# EAGLE design Cansat2019_1516_Payload_SectionA_v03 (EAGLE 7.3.0)
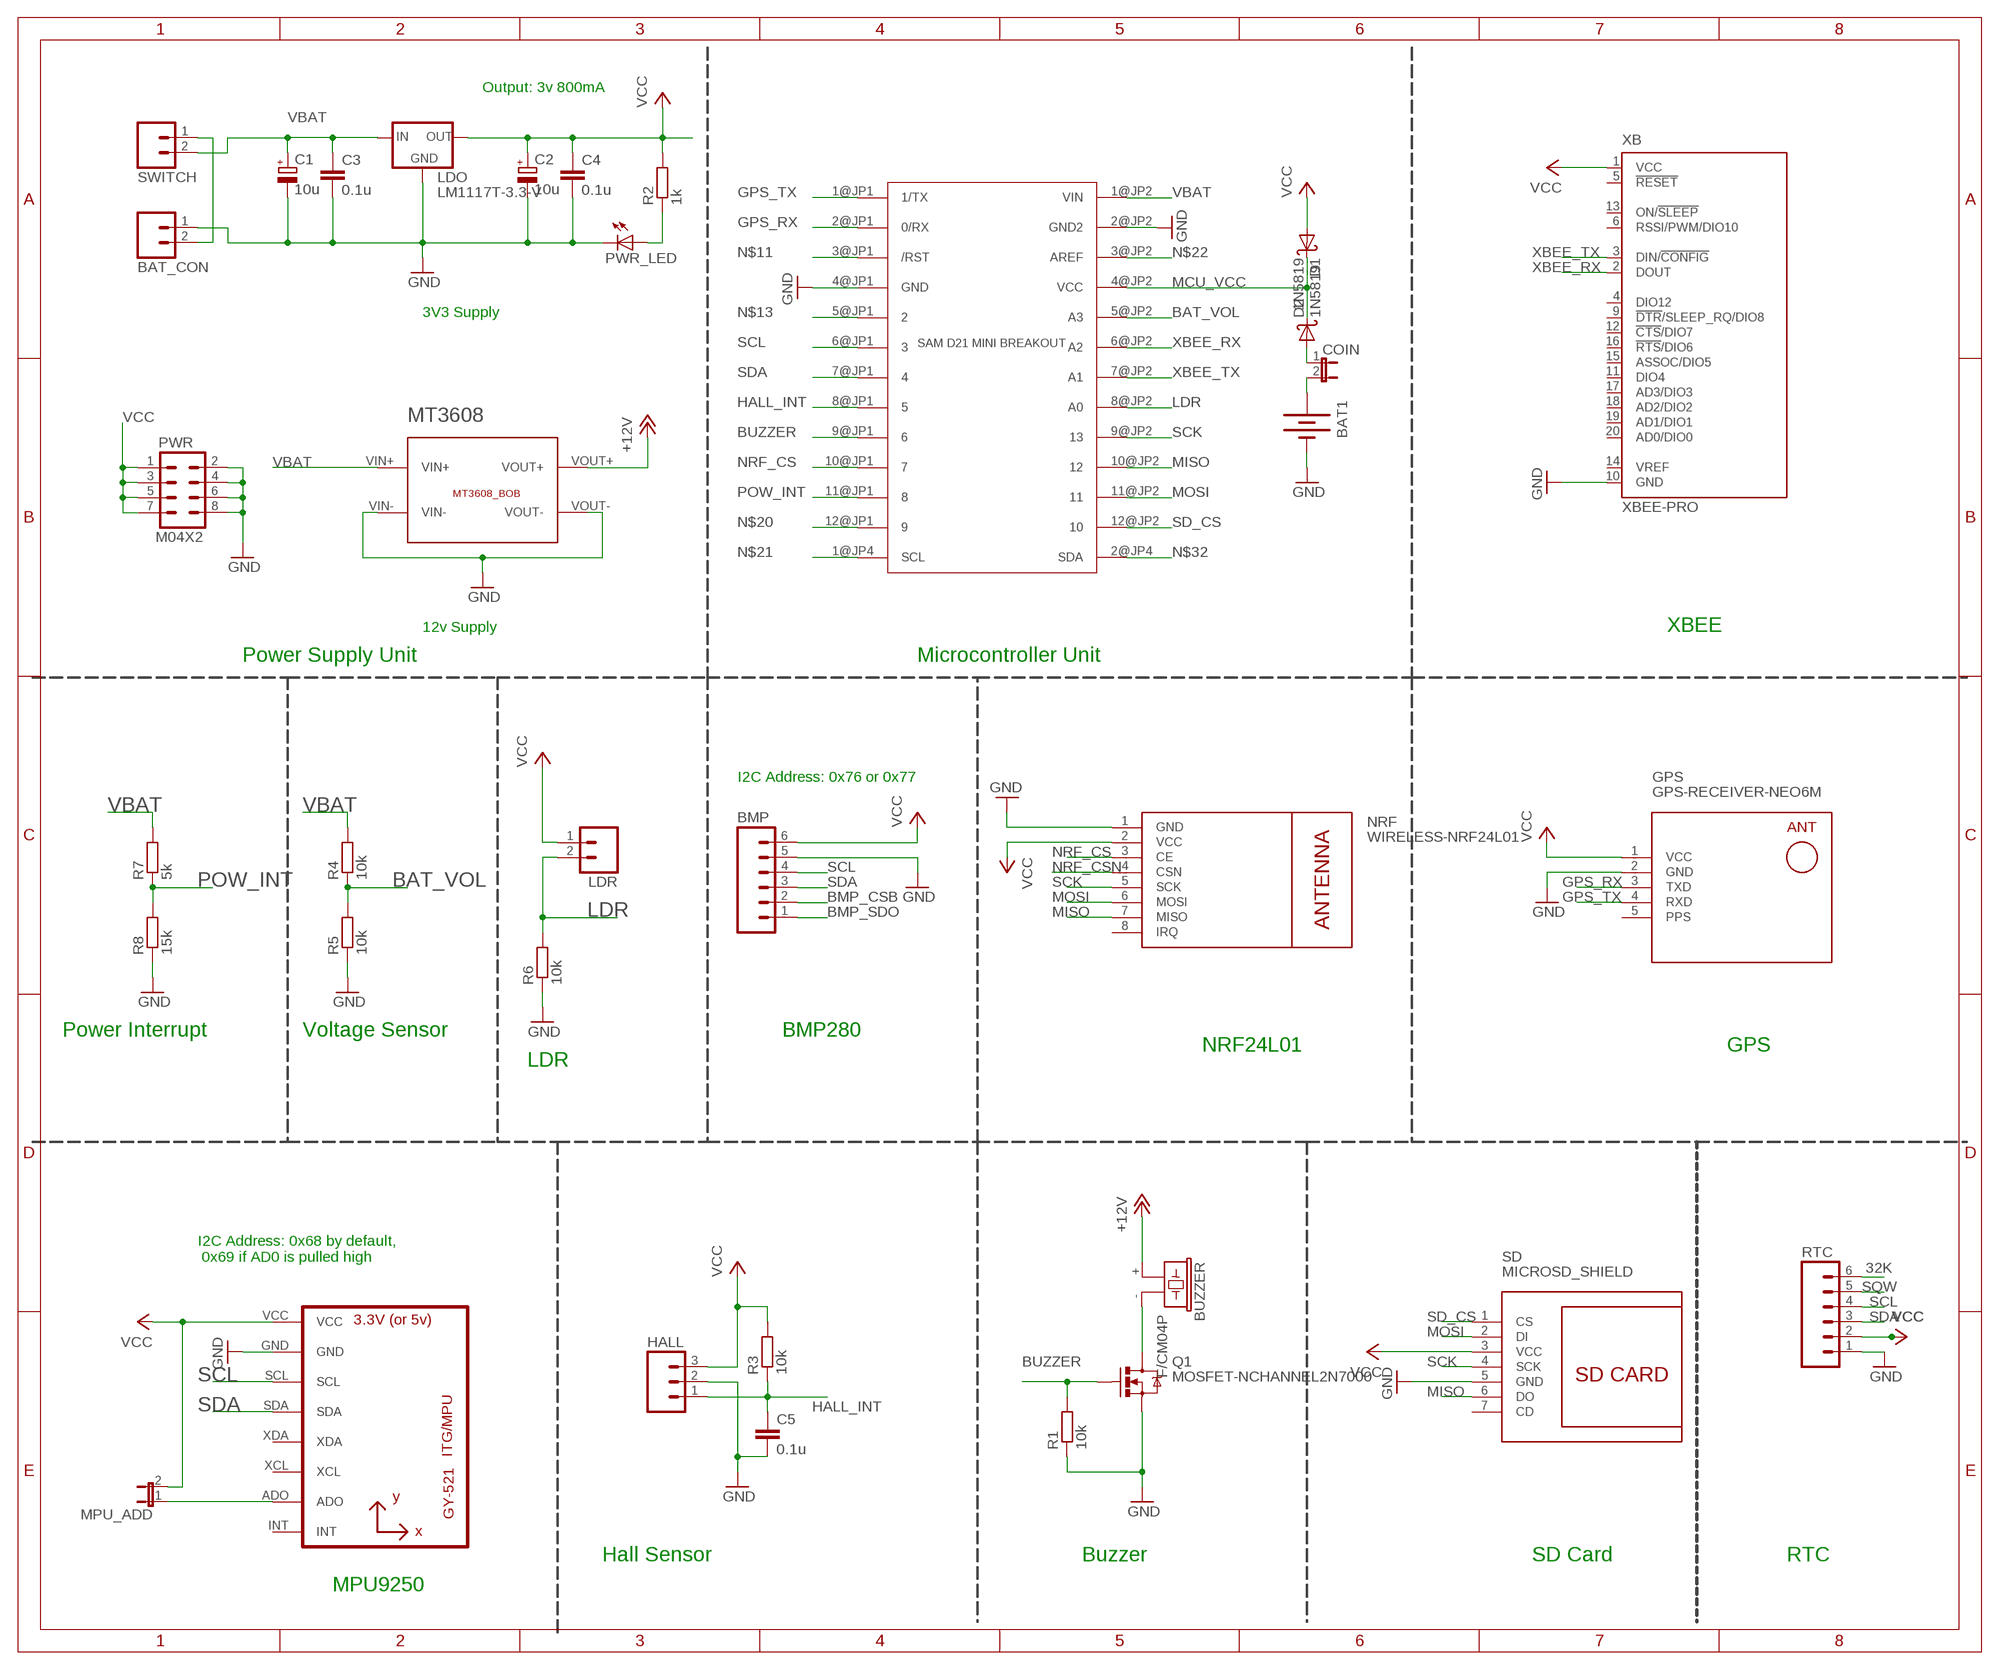
[diagram p0: schematic, sheet 1]

## Parts
BAT1  BATTERY20PTH  [BATTCOM_20MM_PTH]
BAT_CON  M02  [02P]
BMP  M06  [06P]
BUZZER  F/CM04P  [F/CM04P]
C1  10u  CPOL-EUE2.5-6  [E2,5-6]
C2  10u  CPOL-EUE2.5-6  [E2,5-6]
C3  0.1u  C-EU025-025X050  [C025-025X050]
C4  0.1u  C-EU025-025X050  [C025-025X050]
C5  0.1u  C-EU025-025X050  [C025-025X050]
COIN  JUMPER-2PTH  [1X02]
D1  1N5819  [DO41-10]
D2  1N5819  [DO41-10]
GPS  GPS-RECEIVER-NEO6M  [GPS-RECEIVER-NEO6M]
HALL  M03  [03P]
LDO  LM1117T-3.3-V  [TO220V]
LDR  M02  [02P]
MPU  GY-521MPU6050  [GY-521]
MPU_ADD  JUMPER-2PTH  [1X02]
MT3608  MT3608_BOB  [MT3608_BOB]
NRF  WIRELESS-NRF24L01  [WIRELESS-NRF24L01]
PWR  M04X2  [2X4]
PWR_LED  LED3MM  [LED3MM]
Q1  MOSFET-NCHANNEL2N7000  [TO-92]
R1  10k  R-EU_0204/7  [0204/7]
R2  1k  R-EU_0204/7  [0204/7]
R3  10k  R-EU_0204/7  [0204/7]
R4  10k  R-EU_0204/7  [0204/7]
R5  10k  R-EU_0204/7  [0204/7]
R6  10k  R-EU_0204/7  [0204/7]
R7  5k  R-EU_0204/7  [0204/7]
R8  15k  R-EU_0204/7  [0204/7]
RTC  M06  [06P]
SAMD  SAM_D21_MINI_BREAKOUT  [JP1_SPARKFUN-SAMD21-MINI-BREAKOUT-V10]
SD  MICROSD_SHIELD  [MICROSD_SHIELD]
SWITCH  M02  [02P]
XB  XBEE-PRO  [XBEE-PRO]

## Nets
32K: RTC.6
+12V [power]: BUZZER.+ MT3608.VOUT+
BAT_VOL: R4.1 R5.2 SAMD.5@JP2(A3)
BMP_CSB: BMP.2
BMP_SDO: BMP.1
BUZZER: Q1.2(G) R1.2 SAMD.9@JP1
GND [power]: BAT1.2(-) BAT_CON.1 BMP.5 C1.- C2.- C3.2 C4.2 C5.2 GPS.2(GND) HALL.2 LDO.1(GND) MPU.GND MT3608.VIN- MT3608.VOUT- NRF.1(GND) PWR.2 PWR.4 PWR.6 PWR.8 PWR_LED.K(C) Q1.1(S) R1.1 R5.1 R6.1 R8.1 RTC.1 SAMD.2@JP2(GND2) SAMD.4@JP1(GND) SD.5(GND) XB.10(GND)
GPS_RX: GPS.3(TXD) SAMD.2@JP1(0/RX)
GPS_TX: GPS.4(RXD) SAMD.1@JP1(1/TX)
HALL_INT: C5.1 HALL.1 R3.1 SAMD.8@JP1
LDR: LDR.2 R6.2 SAMD.8@JP2(A0)
MCU_VCC [power]: D1.C D2.C SAMD.4@JP2(VCC)
MISO: NRF.7(MISO) SAMD.10@JP2 SD.6(DO)
MOSI: NRF.6(MOSI) SAMD.11@JP2 SD.2(DI)
N$1: BUZZER.- Q1.3(D)
N$2 [power]: COIN.1 D2.A
N$3: PWR_LED.A R2.1
N$5 [power]: BAT1.1(+) COIN.2
N$6: BAT_CON.2 SWITCH.1
N$9: MPU.ADO MPU_ADD.1
N$11: SAMD.3@JP1(/RST)
N$13: SAMD.5@JP1
N$20: SAMD.12@JP1
N$21: SAMD.1@JP4(SCL)
N$22: SAMD.3@JP2(AREF)
N$32: SAMD.2@JP4(SDA)
NRF_CS: NRF.3(CE) SAMD.10@JP1
NRF_CSN: NRF.4(CSN)
POW_INT: R7.1 R8.2 SAMD.11@JP1
SCK: NRF.5(SCK) SAMD.9@JP2 SD.4(SCK)
SCL: BMP.4 MPU.SCL RTC.4 SAMD.6@JP1
SD_CS: SAMD.12@JP2 SD.1(CS)
SDA: BMP.3 MPU.SDA RTC.3 SAMD.7@JP1
SQW: RTC.5
VBAT [power]: C1.+ C3.1 LDO.3(IN) MT3608.VIN+ R4.2 R7.2 SAMD.1@JP2(VIN) SWITCH.2
VCC [power]: BMP.6 C2.+ C4.1 D1.A GPS.1(VCC) HALL.3 LDO.2(OUT) LDR.1 MPU.VCC MPU_ADD.2 NRF.2(VCC) PWR.1 PWR.3 PWR.5 PWR.7 R2.2 R3.2 RTC.2 SD.3(VCC) XB.1(VCC)
XBEE_RX: SAMD.6@JP2(A2) XB.2(DOUT)
XBEE_TX: SAMD.7@JP2(A1) XB.3(DIN/!CONFIG)
Unconnected: MPU.INT MPU.XCL MPU.XDA NRF.8(IRQ) SD.7(CD) XB.4(DIO12) XB.5(!RESET) XB.6(RSSI/PWM/DIO10) XB.9(!DTR!/SLEEP_RQ/DIO8) XB.11(DIO4) XB.12(!CTS!/DIO7) XB.13(ON/!SLEEP) XB.14(VREF) XB.15(ASSOC/DIO5) XB.16(!RTS!/DIO6) XB.17(AD3/DIO3) XB.18(AD2/DIO2) XB.19(AD1/DIO1) XB.20(AD0/DIO0)

## Notes on the sheet
- Output: 3v 800mA
- 3V3 Supply
- 12v Supply | XBEE
- Power Supply Unit | Microcontroller Unit
- I2C Address: 0x76 or 0x77
- Power Interrupt | Voltage Sensor | BMP280
- NRF24L01 | GPS
- LDR
- I2C Address: 0x68 by default,
   0x69 if AD0 is pulled high
- Hall Sensor | Buzzer | SD Card | RTC
- MPU9250

## Power pins joined to a net without a drawn wire
PPS: GPS.5(PPS)

## Library data of the parts
BAT1 = MSP-MB_V12:BATTERY: Battery Holders Various common sizes : AA, AAA, 18650 (PRT-12895), 20mm coin cell and 12mm coin cell. 20MM_4LEGS, BATT-10373
BAT_CON LDR SWITCH = CEDT_JANUARY_2015_v5:M02: AMP QUICK CONNECTOR
BMP RTC = con-amp-quick:M06: AMP QUICK CONNECTOR; OC_FARNELL: unknown; OC_NEWARK: unknown
BUZZER = buzzer:F/CM04P: BUZZER Source: Buerklin; OC_FARNELL: unknown; OC_NEWARK: unknown
C1 C2 = rcl:CPOL-EU: POLARIZED CAPACITOR, European symbol
C3-C5 = rcl:C-EU: CAPACITOR, European symbol
COIN MPU_ADD = SparkFun-Retired:JUMPER-2: Jumper Basic 0.1" spaced jumper. Use with breakaway headers.
D1 D2 = CEDT_JANUARY_2015_v6 (2):1N5819: DIODE general purpose rectifier, 1 A
GPS = diy-modules:GPS-RECEIVER-NEO6M: GPS Receiver Module based on NEO-6 device Short tutorial how to use NEO-6 module with Arduino: http://www.xarg.org/2016/06/neo6mv2-gps-module-with-arduino/ NEO-6 datasheet is available here: https://www.u-blox.com/sites/default/files/products/documents/NEO-6_DataSheet_%28GPS.G6-HW-09005%29.pdf Click here to find device on ebay.com <http://www.ebay.com/sch/gyneo6mv2>
HALL = msp framework:M03: AMP QUICK CONNECTOR
LDO = lm1117:LM1117T-*
MPU = gy-521:GY-521
MT3608 = Breakouts:MT3608_BOB
NRF = diy-modules:WIRELESS-NRF24L01: 2.4 GHz Wireless Module based on NRF24L01 chip More details available here: http://www.electrodragon.com/w/NRF24L01 Click here to find device on ebay.com <http://www.ebay.com/sch/nrf24l01+arduino>
PWR = SparkFun-Connectors:M04X2: .1" header, two rows of four.
PWR_LED = 01_adafruit:LED: LED OSRAM: - CHIPLED LG R971, LG N971, LY N971, LG Q971, LY Q971, LO R971, LY R971 LH N974, LH R974 LS Q976, LO Q976, LY Q976 LO Q996 - Hyper CHIPLED LW Q18S LB Q993, LB Q99A, LB R99A - SideLED LS A670, LO A670, LY A670, LG A670, LP A670 LB A673, LV A673, LT A673, LW A673 LH A674 LY A675 LS A676, LA A676, LO A676, LY A676, LW A676 LS A679, LY A679, LG A679 - Hyper Micro SIDELED® LS Y876, LA Y876, LO Y876, LY Y876 LT Y87S - SmartLED LW L88C, LW L88S LB L89C, LB L89S, LG L890 LS L89K, LO L89K, LY L89K LS L896, LA L896, LO L896, LY L896 - TOPLED LS T670, LO T670, LY T670, LG T670, LP T670 LSG T670, LSP T670, LSY T670, LOP T670, LYG T670 LG T671, LOG T671, LSG T671 LB T673, LV T673, LT T673, LW T673 LH T674 LS T676, LA T676, LO T676, LY T676, LB T676, LH T676, LSB T676, LW T676 LB T67C, LV T67C, LT T67C, LS T67K, LO T67K, LY T67K, LW E67C LS E67B, LA E67B, LO E67B, LY E67B, LB E67C, LV E67C, LT E67C LW T67C LS T679, LY T679, LG T679 LS T770, LO T770, LY T770, LG T770, LP T770 LB T773, LV T773, LT T773, LW T773 LH T774 LS E675, LA E675, LY E675, LS T675 LS T776, LA T776, LO T776, LY T776, LB T776 LHGB T686 LT T68C, LB T68C - Hyper Mini TOPLED® LB M676 - Mini TOPLED Santana® LG M470 LS M47K, LO M47K, LY M47K Source: http://www.osram.convergy.de/
Q1 = SparkFun-DiscreteSemi:MOSFET-NCHANNEL: Common NMOSFET Parts MFG P/N Store ID Prod ID FDD8780 TRANS-09984 SI7820DN TRANS-11055 FDS6630A IC-08089 2N7002PW TRANS-11151 FQP30N06L COM-10213 TRANS-10060 BSS123LT1G TRANS-08345 BSS138 TRANS-00830 BS170 2N7000
R1-R8 = rcl:R-EU_: RESISTOR, European symbol
SAMD = SparkFun-SAMD21-Mini-Breakout:SAM_D21_MINI_BREAKOUT: SPARKFUN-SAMD21-MINI-BREAKOUT
SD = Breakouts:MICROSD_SHIELD
XB = xbee:XBEE: XBee (TM) /XBee-PRO(TM) OEM RF Modules Source: MaxStream, Inc. xbee_productmanual.pdf; MPN: XBP24-AWI-001; OC_FARNELL: 1337916; OC_NEWARK: 42M2667

## Net classes
0 default: width 0.305 mm
1 power: width 0.61 mm, clearance 0.305 mm

## Board
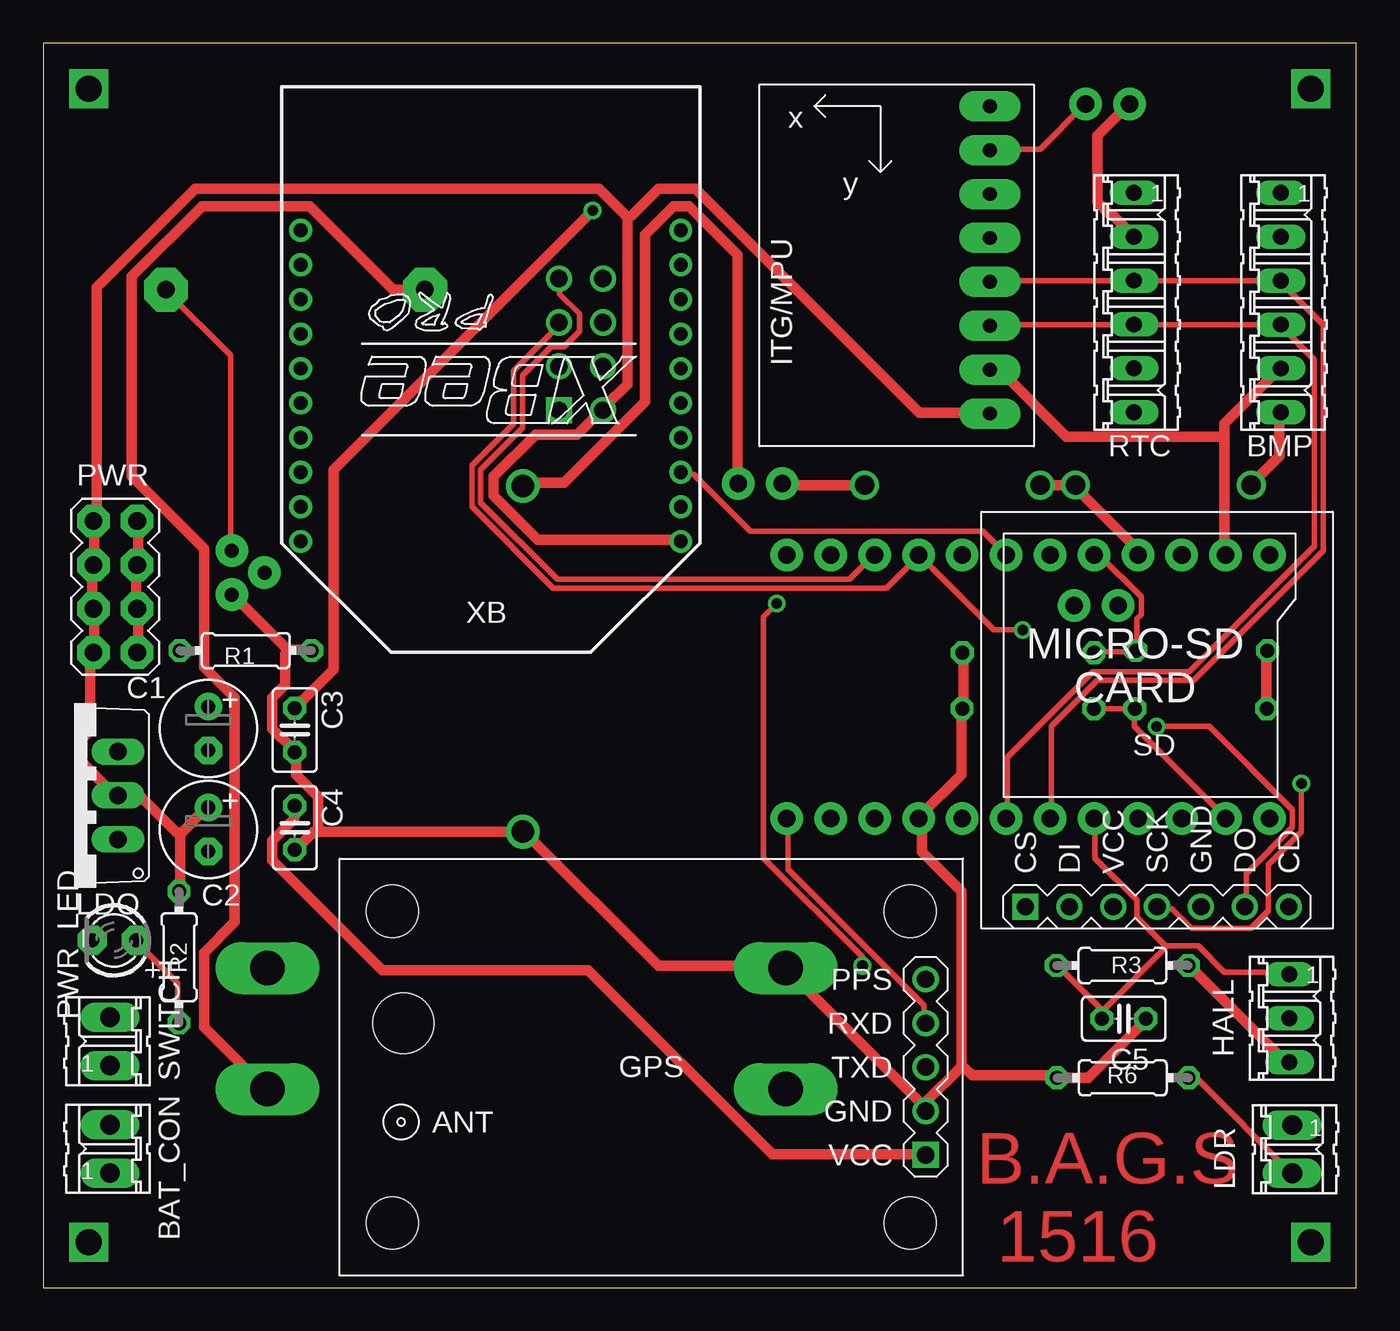
[diagram p1: board, top side]
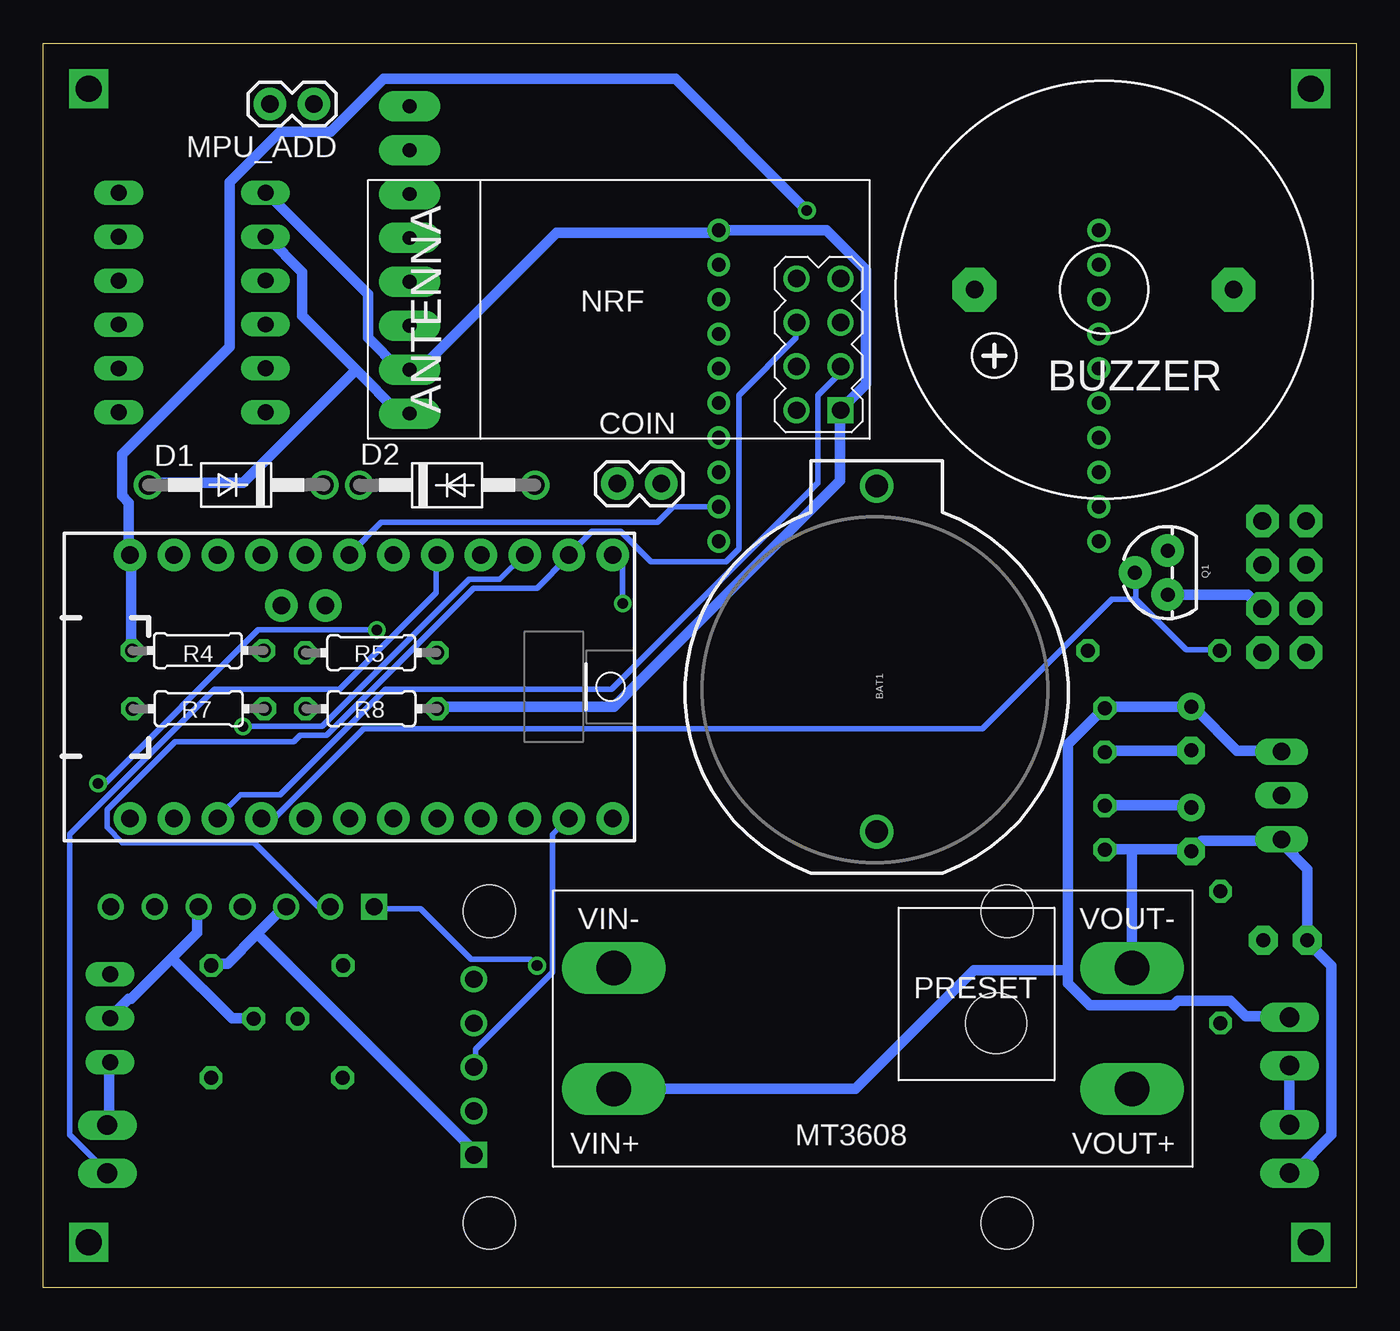
[diagram p2: board, bottom side, seen from below]

Size 76 x 72 mm. Coordinates in mm from the lower left corner, seen from the top.
Outline: 76,72 0,72 0,0 76,0 76,72
Copper layers (1*16): Top 0.035mm / dielectric 1.5mm / Bottom 0.035mm
Design rules "default": minimum track width 10mil, minimum drill 24mil, track to track 8mil, track to pad 8mil, pad to pad 8mil, via to via 8mil, smd to smd 8mil, copper to edge 40mil, drill to drill 8mil, minimum pad ring 10mil, minimum via ring 8mil, stop-mask expansion 4mil, vias tented up to drill 0mil, thermal gap 10mil

### Footprints (pad centres in the part's own frame; a part is rotated, then mirrored left to right if it is on the bottom)
BATTCOM_20MM_PTH = drill 1.3: 1 11.85,0; 2 -8.15,0
02P = drill 1.143 long: 1 -1.397,0; 2 1.397,0
06P = drill 0.914 long: 1 -6.35,0; 2 -3.81,0; 3 -1.27,0; 4 1.27,0; 5 3.81,0; 6 6.35,0
F/CM04P = drill 1.016 pad 2.54 octagon: + 7.493,0; - -7.493,0
E2,5-6 = drill 0.813 pad 1.6: + -1.27,0 | drill 0.813 pad 1.6 octagon: - 1.27,0
C025-025X050 = drill 0.813 octagon: 1 -1.27,0; 2 1.27,0
1X02 = drill 1.016 pad 1.88: 1 0,0; 2 2.54,0
DO41-10 = drill 1.118: A 5.08,0; C -5.08,0
GPS-RECEIVER-NEO6M = drill 1 square: 1 -15.875,5.08 | drill 1: 2 -15.875,2.54; 3 -15.875,0; 4 -15.875,-2.54; 5 -15.875,-5.08 | hole 3: -14.986,9.017; -14.986,-9.017; 14.986,-9.017; 14.986,9.017 | hole 3.5: 14.351,-2.54
03P = drill 0.914 long: 1 -2.54,0; 2 0,0; 3 2.54,0
TO220V = drill 1.016 long: 1 -2.54,-2.54; 2 0,-2.54; 3 2.54,-2.54
GY-521 = drill 0.8 pad 1.778 long: ADO -8.89,-6.35; GND -8.89,6.35; INT -8.89,-8.89; SCL -8.89,3.81; SDA -8.89,1.27; VCC -8.89,8.89; XCL -8.89,-3.81; XDA -8.89,-1.27
MT3608_BOB = drill 2 pad 3 long: VIN+ 33.5,-4.5; VIN- 33.5,-11.5; VOUT+ 3.5,-4.5; VOUT- 3.5,-11.5
WIRELESS-NRF24L01 = drill 1 square: 1 -12.7,6.35 | drill 1: 2 -10.16,6.35; 3 -12.7,3.81; 4 -10.16,3.81; 5 -12.7,1.27; 6 -10.16,1.27; 7 -12.7,-1.27; 8 -10.16,-1.27
2X4 = drill 1.016 pad 1.88 octagon: 1 -3.81,-1.27; 2 -3.81,1.27; 3 -1.27,-1.27; 4 -1.27,1.27; 5 1.27,-1.27; 6 1.27,1.27; 7 3.81,-1.27; 8 3.81,1.27
LED3MM = drill 0.813 pad 1.676 octagon: A -1.27,0; K 1.27,0
TO-92 = drill 0.813 pad 1.88: 1 -1.27,0; 2 0,1.905; 3 1.27,0
0204/7 = drill 0.813 octagon: 1 -3.81,0; 2 3.81,0
JP1_SPARKFUN-SAMD21-MINI-BREAKOUT-V10 = drill 1.016 pad 1.88: 1@JP1 1.27,1.27; 1@JP2 16.51,29.21; 1@JP4 13.589,17.907; 2@JP1 1.27,3.81; 2@JP2 16.51,26.67; 2@JP4 13.589,20.447; 3@JP1 1.27,6.35; 3@JP2 16.51,24.13; 4@JP1 1.27,8.89; 4@JP2 16.51,21.59; 5@JP1 1.27,11.43; 5@JP2 16.51,19.05; 6@JP1 1.27,13.97; 6@JP2 16.51,16.51; 7@JP1 1.27,16.51; 7@JP2 16.51,13.97; 8@JP1 1.27,19.05; 8@JP2 16.51,11.43; 9@JP1 1.27,21.59; 9@JP2 16.51,8.89; 10@JP1 1.27,24.13; 10@JP2 16.51,6.35; 11@JP1 1.27,26.67; 11@JP2 16.51,3.81; 12@JP1 1.27,29.21; 12@JP2 16.51,1.27
MICROSD_SHIELD = drill 1 square: 1 1.27,17.78 | drill 1: 2 1.27,15.24; 3 1.27,12.7; 4 1.27,10.16; 5 1.27,7.62; 6 1.27,5.08; 7 1.27,2.54
XBEE-PRO = drill 0.8 pad 1.27: 1 -11,9; 2 -11,7; 3 -11,5; 4 -11,3; 5 -11,1; 6 -11,-1; 7 -11,-3; 8 -11,-5; 9 -11,-7; 10 -11,-9; 11 11,-9; 12 11,-7; 13 11,-5; 14 11,-3; 15 11,-1; 16 11,1; 17 11,3; 18 11,5; 19 11,7; 20 11,9

### Placement (x,y rotation side)
BAT1  27.76,34.53 90 bottom
BAT_CON  3.87,8.03 90 top
BMP  71.63,56.99 270 top
BUZZER  14.6,57.74 180 bottom
C1  9.56,32.35 270 top
C2  9.56,26.51 270 top
C3  14.56,32.26 270 top
C4  14.56,26.61 270 top
C5  62.54,15.56 0 top
COIN  42.77,46.52 0 bottom
D1  64.83,46.44 180 bottom
D2  52.62,46.44 0 bottom
GPS  35.2,12.76 180 top
HALL  72.13,15.59 270 top
LDO  1.79,28.48 90 top
LDR  72.29,8.01 270 top
MPU  45.91,59.47 180 top
MPU_ADD  60.33,68.48 180 bottom
MT3608  9.48,6.99 180 bottom
NRF  42.55,57.11 180 bottom
PWR  4.17,40.55 270 top
PWR_LED  4.1,20.09 180 top
Q1  10.91,41.37 90 bottom
R1  11.72,36.86 180 top
R2  7.86,19.12 90 top
R3  62.46,18.64 0 top
R4  67.05,36.86 180 bottom
R5  57.02,36.73 180 bottom
R6  62.48,12.14 0 top
R7  67,33.5 180 bottom
R8  57,33.5 180 bottom
RTC  63.13,57 270 top
SAMD  41.77,25.87 90 bottom
SD  74.63,20.77 90 top
SWITCH  3.87,14.25 90 top
XB  25.9,52.18 180 top

### Tracks (layer width: path | path; a pad name or v marks a point on that pad's centre or on a via)
+12V
  Top 0.61: BUZZER.+ 22.02,57.74 20.24,57.74 15.41,62.57 9.19,62.57 5.13,58.5 5.13,46.95 9.32,42.76 9.32,35.9 11.1,34.12 11.1,21.17 9.32,19.39 9.32,15.07 12.87,11.51 MT3608.VOUT+
BAT_VOL
  Top 0.305: R5.2 60.88,36.79 63.16,36.79 R4.1 63.29,36.91 63.29,38.69 63.55,38.95 63.55,39.96 61.13,42.38 60.88,42.38 SAMD.5@JP2
BUZZER
  Bottom 0.305: 12.75,39.83 9.82,36.91 7.92,36.91 R1.2 | 12.75,39.83 12.75,41.36 Q1.2 | 12.75,39.83 14.14,39.83 21.64,32.34 57.45,32.34 62.53,27.26 63.29,27.26 SAMD.9@JP1
GND
  Top 0.61: 68.37,49.23 68.37,42.5 SAMD.2@JP2 | 68.37,49.23 68.37,50 71.55,53.17 BMP.5 | 68.37,49.23 59.23,49.23 55.42,53.04 54.91,53.04 MPU.GND | R5.1 53.26,36.66 53.26,33.61 R8.1 53.13,33.23 53.13,29.67 50.72,27.26 50.72,27.14 SAMD.4@JP1 50.85,26.88 50.85,25.23 53.13,22.94 53.13,12.78 | 51.1,10.12 GPS.2 | GPS.2 50.97,10.5 43.1,18.37 MT3608.VIN- 42.72,18.63 35.61,18.63 27.99,26.25 BAT1.2 27.73,26.37 15.92,26.37 | 71.04,15.58 72.06,15.58 HALL.2 | 14.14,36.91 15.41,36.91 R1.1 | 14.14,36.91 10.97,40.09 Q1.1 | PWR.8 5.51,36.79 5.51,39.2 PWR.6 5.38,39.58 5.38,41.74 PWR.4 5.51,42.12 5.51,44.28 PWR.2 | 15.92,26.37 15.67,26.37 14.65,25.36 C4.2 | 15.92,26.37 15.92,28.41 14.65,29.67 14.65,30.94 C3.2 14.4,31.2 13.25,32.34 13.25,34.12 14.02,34.88 14.02,36.66 14.14,36.91 | C5.2 63.8,15.45 60.5,12.15 58.72,12.15 R6.1 58.47,12.28 53.77,12.28 53.39,12.66 53.13,12.78 | 53.13,12.78 51.1,10.75 GPS.2
  Bottom 0.61: RTC.1 63.04,63.33 57.2,57.49 57.2,54.95 55.42,53.17 54.91,53.17 MPU.GND 54.53,53.17 54.15,53.17 46.27,61.04 37.13,61.04 XB.10 36.88,61.17 30.65,61.17 28.37,58.89 28.37,52.28 29.76,50.88 NRF.1 29.89,50.5 29.89,46.69 42.97,33.61 53.13,33.61 R8.1 | 68.56,19.07 67.1,20.53 67.1,21.93 SD.5 | 68.56,19.07 70.91,16.72 71.04,16.72 72.06,15.7 HALL.2 | Q1.1 10.84,40.09 6.27,40.09 5.51,39.33 PWR.6 | C3.2 14.52,31.07 9.57,31.07 C1.- | 13,25.36 9.57,25.36 C2.- 9.32,25.48 8.94,25.87 4.36,25.87 LDO.1 4.24,25.61 2.84,24.21 2.84,20.15 PWR_LED.K 2.71,19.9 1.44,18.63 1.44,8.85 3.6,6.69 3.86,6.69 BAT_CON.1 | 13,25.36 14.52,25.36 C4.2 | 13,25.36 13,18.5 MT3608.VOUT- | 68.56,19.07 65.07,15.58 63.93,15.58 C5.2
GPS_RX
  Bottom 0.305: GPS.3 50.97,12.78 50.97,13.8 46.53,18.24 46.53,26.25 45.64,27.14 SAMD.2@JP1
GPS_TX
  Top 0.305: GPS.4 50.97,15.32 50.97,16.34 43.1,24.21 43.1,27.14 SAMD.1@JP1
HALL_INT
  Top 0.305: 60.88,27.14 SAMD.8@JP1 60.88,27.01 60.88,24.85 63.29,22.44 63.29,21.42 64.94,19.77 65.07,19.77 | R3.1 58.72,18.63 61.26,16.09 61.26,15.58 C5.1 61.39,16.09 65.07,19.77 | 65.07,19.77 66.85,19.77 68.37,18.24 72.06,18.24 HALL.1
LDR
  Top 0.305: R6.2 66.34,12.02 66.85,12.02 72.18,6.69 LDR.2
  Bottom 0.305: SAMD.8@JP2 53.26,42.38 53.26,40.22 58.85,34.63 66.09,34.63 74.47,26.25 74.47,8.85 72.31,6.69 LDR.2
MCU_VCC
  Top 0.61: D2.C 59.74,46.44 D1.C 59.86,46.19 63.29,42.76 63.29,42.5 SAMD.4@JP2
MISO  (via drill 0.61)
  Top 0.305: NRF.7 29.89,58.38 29.89,57.49 31.03,56.34 31.03,55.33 30.14,54.44 29.38,54.44 27.73,52.79 27.73,49.74 25.32,47.33 25.32,45.42 29.76,40.98 46.66,40.98 48.05,42.38 SAMD.10@JP2 | v64.44,32.47 67.48,32.47 72.31,27.64 72.31,26.63 69.64,23.96 69.64,22.05 SD.6
  Bottom 0.305: v64.44,32.47 59.86,32.47 51.35,40.98 49.58,40.98 48.18,42.38 SAMD.10@JP2
MOSI
  Bottom 0.305: NRF.6 32.43,55.84 32.43,54.95 35.73,51.65 35.73,42.76 36.5,41.99 40.81,41.99 42.59,43.77 44.24,43.77 45.51,42.5 SAMD.11@JP2 45.64,42.25 47.42,40.47 51.1,40.47 59.61,31.96 61.13,31.96 61.51,31.58 68.37,31.58 72.31,27.64 72.31,26.63 71.42,25.74 63.8,25.74 60.12,22.05 59.48,22.05 SD.2
N$1
  Top 0.305: Q1.3 10.84,42.76 10.84,53.93 7.16,57.61 BUZZER.-
N$2
  Top 0.61: D2.A 47.42,46.44 42.84,46.44 COIN.1
N$3
  Top 0.305: R2.1 7.79,15.32 7.79,17.61 5.38,20.02 PWR_LED.A
N$4  (via drill 1.5)
  other vias: 2.62,2.62
N$5
  Top 0.61: COIN.2 40.18,46.57 40.18,59.77 37.38,62.57 36.5,62.57 34.84,60.92 34.84,51.27 30.14,46.57 27.99,46.57 27.86,46.44 BAT1.1
N$6
  Bottom 0.61: BAT_CON.2 SWITCH.1
N$7  (via drill 1.5)
  other vias: 2.62,69.38
N$8  (via drill 1.5)
  other vias: 73.38,69.38
N$9
  Top 0.305: MPU.ADO 54.91,65.87 57.7,65.87 60.24,68.41 MPU_ADD.1
N$10  (via drill 1.5)
  other vias: 73.38,2.62
NRF_CS
  Bottom 0.305: NRF.3 29.89,53.3 29.89,52.92 31.16,51.65 31.16,46.57 43.1,34.63 56.18,34.63 62.28,28.53 64.56,28.53 65.83,27.26 SAMD.10@JP1
POW_INT
  Top 0.305: R8.2 60.88,33.48 63.16,33.48 R7.1 63.16,33.36 63.16,32.47 68.37,27.26 SAMD.11@JP1
SCK  (via drill 0.61)
  Top 0.305: v72.82,29.17 72.82,26.37 70.91,24.47 70.91,21.8 69.9,20.78 66.47,20.78 65.32,21.93 64.56,21.93 SD.4 | v56.69,38.06 55.04,38.06 50.72,42.38 SAMD.9@JP2 50.59,42.25 48.81,40.47 29.51,40.47 24.81,45.17 24.81,47.58 27.22,50 27.22,53.04 29.76,55.58 29.76,55.84 NRF.5
  Bottom 0.305: v72.82,29.17 72.44,29.17 63.55,38.06 v56.69,38.06
SCL
  Top 0.305: MPU.SCL 54.91,55.71 63.04,55.71 RTC.4 63.16,55.71 71.55,55.71 BMP.4 71.67,55.58 73.58,53.68 73.58,42.88 66.34,35.64 60.75,35.64 55.8,30.69 55.8,27.26 SAMD.6@JP1
SD_CS  (via drill 0.61)
  Top 0.305: v47.42,18.63 47.42,19.13 41.7,24.85 41.7,38.82 v42.46,39.58
  Bottom 0.305: v47.42,18.63 47.8,19.01 51.23,19.01 54.15,21.93 56.81,21.93 SD.1 | v42.46,39.58 42.46,41.87 42.97,42.38 SAMD.12@JP2
SDA
  Top 0.305: MPU.SDA 54.91,58.25 63.04,58.25 RTC.3 63.16,58.25 71.55,58.25 BMP.3 71.67,58.12 74.09,55.71 74.09,42.63 66.59,35.14 61.01,35.14 58.34,32.47 58.34,27.26 SAMD.7@JP1
VBAT  (via drill 0.61)
  Top 0.61: R7.2 70.78,33.61 70.78,36.79 R4.2 | v31.8,62.31 16.81,47.33 16.81,35.77 14.65,33.61 C3.1
  Bottom 0.61: R4.2 70.91,36.91 70.91,42.38 SAMD.1@JP2 71.04,42.63 71.04,45.42 71.42,45.8 71.42,48.22 65.2,54.44 65.2,63.97 62.28,66.89 59.35,66.89 56.31,69.93 39.42,69.93 v31.8,62.31 | LDO.3 4.36,31.07 6.9,31.07 9.32,33.48 C1.+ 9.57,33.61 14.52,33.61 C3.1 14.78,33.36 16.68,31.45 16.68,18.37 | 16.68,18.37 16.68,17.61 15.41,16.34 10.59,16.34 10.33,16.59 7.29,16.59 6.4,15.7 3.98,15.7 SWITCH.2 | 16.68,18.37 22.14,18.37 29,11.51 42.97,11.51 MT3608.VIN+
VCC
  Top 0.61: XB.1 36.88,43.26 28.62,43.26 26.08,45.8 26.08,46.95 28.49,49.36 30.91,49.36 32.3,50.76 NRF.2 32.56,51.01 33.83,52.28 33.83,61.93 | BMP.6 71.55,50.63 71.55,48.09 70.02,46.57 D1.A | RTC.2 63.04,60.92 61.9,62.06 61.77,62.06 61.01,62.82 61.01,66.63 62.78,68.41 MPU_ADD.2 | 7.92,26.25 7.92,22.94 R2.2 | 7.92,26.25 9.44,27.77 C2.+ | 7.92,26.25 7.67,26.37 5.63,28.41 4.36,28.41 LDO.2 4.11,28.53 2.08,30.56 2.08,31.58 2.71,32.22 2.71,36.53 PWR.7 2.97,36.79 2.97,39.2 PWR.5 2.84,39.58 2.84,41.74 PWR.3 2.97,42.12 2.97,44.41 PWR.1 3.09,44.66 3.09,57.87 8.81,63.58 32.18,63.58 33.83,61.93 | C4.1 14.52,27.77 14.52,27.14 13.25,25.87 13.25,24.72 19.6,18.37 31.54,18.37 42.21,7.7 50.97,7.7 GPS.1 | MPU.VCC 54.78,50.63 50.72,50.63 37.77,63.58 35.61,63.58 34.08,62.06 33.83,61.93 | R3.2 66.34,18.63 71.8,13.16 72.06,13.16 HALL.3
  Bottom 0.61: 57.9,53.11 61.01,56.22 61.01,58.76 63.04,60.79 RTC.2 | 57.9,53.11 55.42,50.63 54.91,50.63 MPU.VCC | 57.9,53.11 64.44,46.57 69.9,46.57 D1.A | C4.1 14.52,27.9 9.57,27.9 C2.+ | 72.06,13.16 HALL.3 72.18,12.78 72.18,9.48 LDR.1 | 51.1,7.7 GPS.1 51.1,7.96 63.61,20.47 | 62.02,21.93 SD.3 62.28,21.8 63.61,20.47 | 63.61,20.47 65.32,18.75 66.21,18.75 R3.2
XBEE_RX
  Bottom 0.305: XB.2 37,45.17 39.54,45.17 40.43,44.28 56.43,44.28 58.21,42.5 SAMD.6@JP2
XBEE_TX
  Top 0.305: XB.3 37,47.07 37.64,47.07 40.94,43.77 54.4,43.77 55.67,42.5 SAMD.7@JP2

### Text on the board
Top: B.A.G.S / 1516
tStop: B.A.G.S / 1516